# Altium schematic sheet Power.SchDoc: Power
size A3; DocumentNumber: MB1144; Revision: C-02; SheetNumber: 7; SheetTotal: 25; Project: STM32L476G-EVAL; ModifiedDate: 9/23/2015
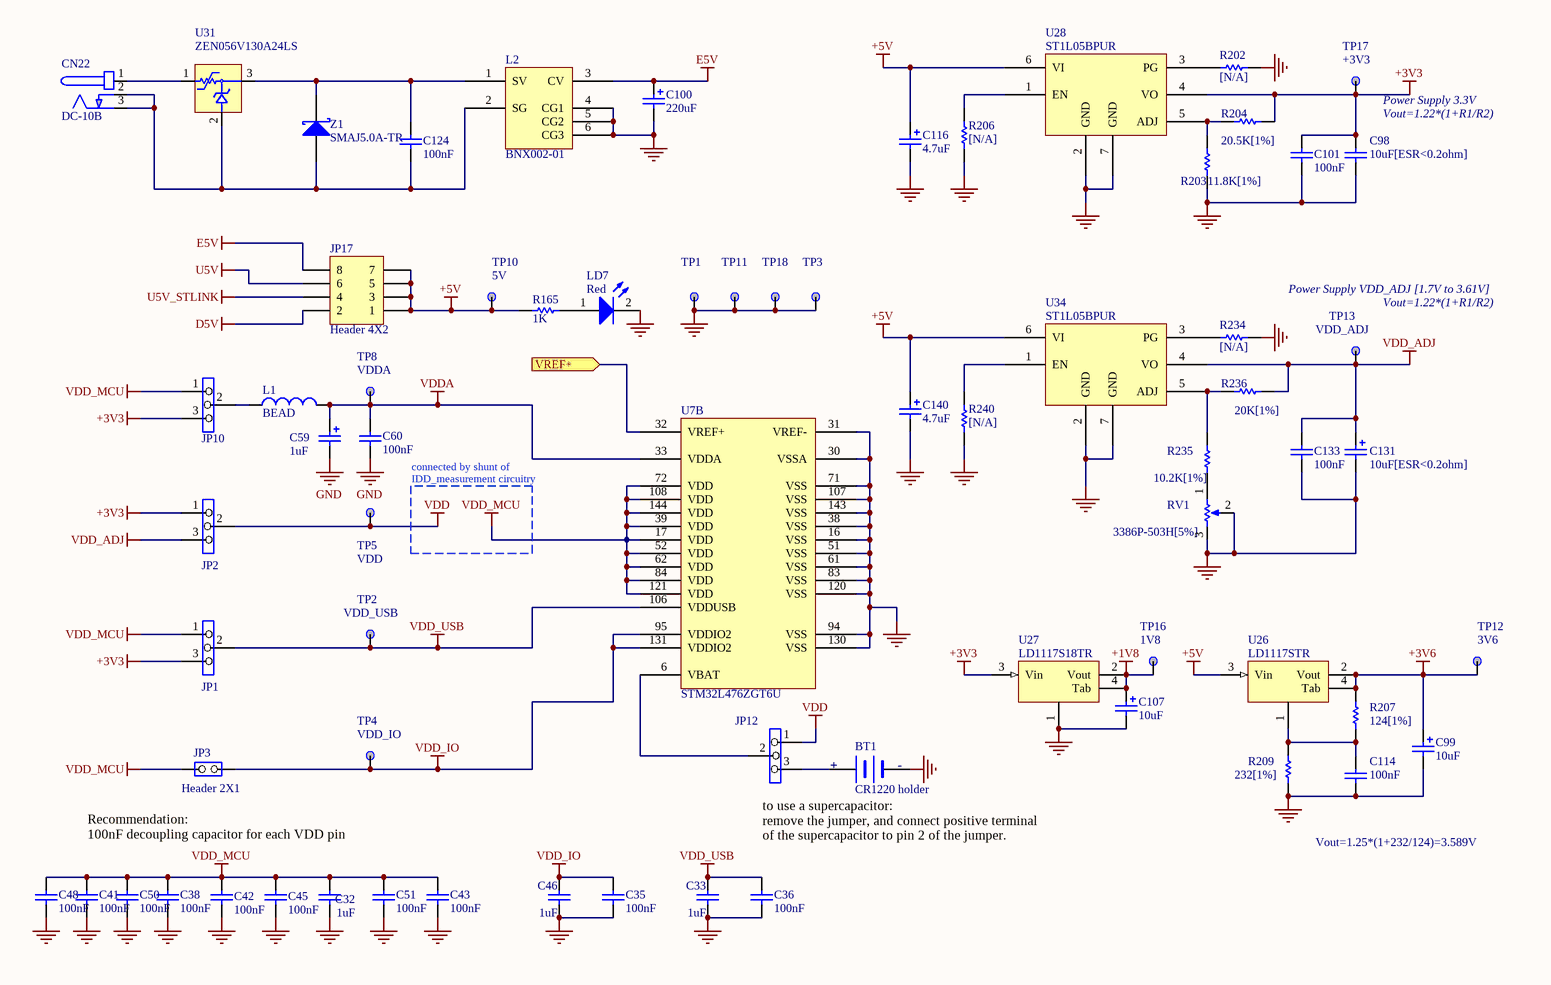
[diagram p0: Power.SchDoc]

## Parts
BT1  CR1220 holder  [BAT_2SM_CR1220]
C32  1uF  [0603C]
C33  1uF  [0603C]
C35  100nF  [0402C]
C36  100nF  [0402C]
C38  100nF  [0402C]
C41  100nF  [0402C]
C42  100nF  [0402C]
C43  100nF  [0402C]
C45  100nF  [0402C]
C46  1uF  [0603C]
C48  100nF  [0402C]
C50  100nF  [0402C]
C51  100nF  [0402C]
C59  1uF  [TAN-A]
C60  100nF  [0402C]
C98  10uF[ESR<0.2ohm]  [0805C]
C99  10uF  [TAN-A]
C100  220uF  [c310m-6]
C101  100nF  [0402C]
C107  10uF  [TAN-A]
C114  100nF  [0402C]
C116  4.7uF  [TAN-A]
C124  100nF  [0402C]
C131  10uF[ESR<0.2ohm]  [0805C]
C133  100nF  [0402C]
C140  4.7uF  [TAN-A]
CN22  DC-10B  [PWR_JACK_DC10]
JP1  Header 3X1  [SIP3]  (value not drawn)
JP2  Header 3X1  [SIP3]  (value not drawn)
JP3  Header 2X1  [SIP2]
JP10  Header 3X1  [SIP3]  (value not drawn)
JP12  Header 3X1  [SIP3]  (value not drawn)
JP17  Header 4X2  [HDR_2X4_2R54]
L1  BEAD  [0603L]
L2  BNX002-01  [BNX001]
LD7  Red  [0603D]
R165  1K  [0402R]
R202  [N/A]  [0603R]
R203  11.8K[1%]  [0603R]
R204  20.5K[1%]  [0603R]
R206  [N/A]  [0603R]
R207  124[1%]  [0603R]
R209  232[1%]  [0603R]
R234  [N/A]  [0603R]
R235  10.2K[1%]  [0603R]
R236  20K[1%]  [0603R]
R240  [N/A]  [0603R]
RV1  3386P-503H[5%]  [3386P]
TP1  [N/A]  [TP]  (value not drawn)
TP2  TP Name: VDD_USB  [TP]  (hidden comment: [N/A])
TP3  [N/A]  [TP]  (value not drawn)
TP4  TP Name: VDD_IO  [TP]  (hidden comment: [N/A])
TP5  TP Name: VDD  [TP]  (hidden comment: [N/A])
TP8  TP Name: VDDA  [TP]  (hidden comment: [N/A])
TP10  TP Name: 5V  [TP]  (hidden comment: [N/A])
TP11  [N/A]  [TP]  (value not drawn)
TP12  TP Name: 3V6  [TP]  (hidden comment: [N/A])
TP13  TP Name: VDD_ADJ  [TP]  (hidden comment: [N/A])
TP16  TP Name: 1V8  [TP]  (hidden comment: [N/A])
TP17  TP Name: +3V3  [TP]  (hidden comment: [N/A])
TP18  [N/A]  [TP]  (value not drawn)
U7  STM32L476ZGT6U  [TQFP144_0R5_22X22_SOCKET]  (part B of 3)
U26  LD1117STR  [SOT-223]
U27  LD1117S18TR  [SOT-223]
U28  ST1L05BPUR  [DFN6_0R95_3X3]
U31  ZEN056V130A24LS  [TYCO_ZEN056V130A24LS]
U34  ST1L05BPUR  [DFN6_0R95_3X3]
Z1  SMAJ5.0A-TR  [sma]

## Ports
VREF+ (in)

## Nets
+1V8: C107.1 TP16.1 U27.2(Vout) U27.4(Tab)
+3V3: C98.1 C101.1 JP1.3 JP2.1 JP10.3 R204.1 TP17.1 U27.3(Vin) U28.4(VO)
+3V6: C99.1 R207.2 TP12.1 U26.2(Vout) U26.4(Tab)
+5V: C116.1 C140.1 JP17.1 JP17.3 JP17.5 JP17.7 R165.2 TP10.1 U26.3(Vin) U28.6(VI) U34.6(VI)
D5V: JP17.2
E5V: C100.1 JP17.8 L2.3(CV)
GND: BT1.2(-) C32.2 C33.2 C35.1 C36.1 C38.1 C41.1 C42.2 C43.1 C45.2 C46.2 C48.1 C50.1 C51.1 C59.2 C60.1 C98.2 C99.2 C100.2 C101.2 C107.2 C114.2 C116.2 C131.2 C133.2 C140.2 L2.4(CG1) L2.5(CG2) L2.6(CG3) LD7.2(K) R202.1 R203.2 R206.2 R209.1 R234.1 R240.2 RV1.2(TAP) RV1.3(TOP) TP1.1 TP3.1 TP11.1 TP18.1 U7.16(VSS) U7.30(VSSA) U7.31(VREF-) U7.38(VSS) U7.51(VSS) U7.61(VSS) U7.71(VSS) U7.83(VSS) U7.94(VSS) U7.107(VSS) U7.120(VSS) U7.130(VSS) U7.143(VSS) U27.1 U28.2(GND) U28.7(GND) U34.2(GND) U34.7(GND)
U5V: JP17.6
U5V_STLINK: JP17.4
VDD: JP2.2 JP12.1 TP5.1
VDD_ADJ: C131.1 C133.1 JP2.3 R236.1 TP13.1 U34.4(VO)
VDD_IO: C35.2 C46.1 JP3.2(NO) TP4.1 U7.95(VDDIO2) U7.131(VDDIO2)
VDD_MCU: C32.1 C38.2 C41.2 C42.1 C43.2 C45.1 C48.2 C50.2 C51.2 JP1.1 JP3.1(COMMON) JP10.1 U7.17(VDD) U7.39(VDD) U7.52(VDD) U7.62(VDD) U7.72(VDD) U7.84(VDD) U7.108(VDD) U7.121(VDD) U7.144(VDD)
VDD_USB: C33.1 C36.2 JP1.2 TP2.1 U7.106(VDDUSB)
VDDA: C59.1 C60.2 L1.2 TP8.1 U7.33(VDDA)
VREF+: U7.32(VREF+) ; port VREF+
NetBT1_1: BT1.1(+) JP12.3
NetC114_1: C114.1 R207.1 R209.2 U26.1
NetC124_1: C124.1 L2.1(SV) U31.3 Z1.2(K)
NetC124_2: C124.2 CN22.2(GND) CN22.3(GND) L2.2(SG) U31.2 Z1.1(A)
NetCN22_1: CN22.1(+) U31.1
NetJP10_2: JP10.2 L1.1
NetJP12_2: JP12.2 U7.6(VBAT)
NetLD7_1: LD7.1(A) R165.1
NetR202_2: R202.2 U28.3(PG)
NetR203_1: R203.1 R204.2 U28.5(ADJ)
NetR206_1: R206.1 U28.1(EN)
NetR234_2: R234.2 U34.3(PG)
NetR235_1: R235.1 R236.2 U34.5(ADJ)
NetR235_2: R235.2 RV1.1(BOT)
NetR240_1: R240.1 U34.1(EN)

## Notes on the sheet
- Power Supply 3.3V
- Vout=1.22*(1+R1/R2)
- Power Supply VDD_ADJ [1.7V to 3.61V]
- (near TP13) Vout=1.22*(1+R1/R2)
- connected by shunt of
  IDD_measurement circuitry
- (near BT1) +
- (near BT1) -
- Recommendation:
  100nF decoupling capacitor for each VDD pin
- to use a supercapacitor:
  remove the jumper, and connect positive terminal
  of the supercapacitor to pin 2 of the jumper.
- Vout=1.25*(1+232/124)=3.589V
- Title:
- Project:
- Size:
- Date:
- A3
- Reference:
- Sheet:
- Revision:
- of

## Library data of the parts
BT1 = BATTERY: Ordered by: Subcon; Assembly: with battery; ECCN_US/EU: NA
C32 C33 C46 = CAP: Capacitor; Value: 100nF; Ordered by: Subcon; ECCN_US/EU: NA; Published: 8-Jun-2000; Revision: July-2002: Re-released for DXP Platform.; Publisher: Altium Limited
C35 C36 C60 C98 C101 C114 C133 = Cap: Capacitor; Value: 10nF; Ordered by: Subcon; ECCN_US/EU: NA; Published: 8-Jun-2000; Revision: July-2002: Re-released for DXP Platform.; Publisher: Altium Limited
C38 C41-C43 C45 C48 C50 C51 = CAP: Capacitor; Ordered by: Subcon; ECCN_US/EU: NA; Published: 8-Jun-2000; Revision: July-2002: Re-released for DXP Platform.; Publisher: Altium Limited; Value: 100nF
C59 C131 = Cap Pol1: Polarized Capacitor (Radial); Value: 10uF; Ordered by: Subcon; ECCN_US/EU: NA; Published: 8-Jun-2000; Revision: July-2002: Re-released for DXP Platform.; Publisher: Altium Limited
C99 = Cap Pol1: Polarized Capacitor (Radial); ECCN_US/EU: NA; Ordered by: Subcon; Published: 8-Jun-2000; Revision: July-2002: Re-released for DXP Platform.; Publisher: Altium Limited; Value: 10uF
C100 = Cap Pol1: Polarized Capacitor (Radial); Value: 47uF; Ordered by: Subcon; ECCN_US/EU: NA; Published: 8-Jun-2000; Revision: July-2002: Re-released for DXP Platform.; Publisher: Altium Limited
C107 = Cap Pol1: Polarized Capacitor (Radial); Ordered by: Subcon; ECCN_US/EU: NA; Published: 8-Jun-2000; Revision: July-2002: Re-released for DXP Platform.; Publisher: Altium Limited; Value: 10uF
C116 C140 = Cap Pol1: Polarized Capacitor (Radial); Value: 100pF; Ordered by: Subcon; ECCN_US/EU: NA; Published: 8-Jun-2000; Revision: July-2002: Re-released for DXP Platform.; Publisher: Altium Limited
C124 = CAP: Capacitor; Value: 100pF; Ordered by: Subcon; ECCN_US/EU: NA; Published: 8-Jun-2000; Revision: July-2002: Re-released for DXP Platform.; Publisher: Altium Limited
CN22 = PJ202A: Ordered by: Subcon; Comments: power jack; ECCN_US/EU: NA
JP1 JP2 JP10 JP12 = Jumper3: Ordered by: Subcon; ECCN_US/EU: NA
JP3 = JP2: Ordered by: Subcon; ECCN_US/EU: NA
JP17 = Header 4X2: Header, 4-Pin, Dual row; Ordered by: Subcon; ECCN_US/EU: NA; Revision: 17-Jul-2002: Re-released for DXP Platform.; Publisher: Altium Limited
L1 = Inductor: Value: 100uH; Ordered by: Subcon; ECCN_US/EU: NA; Published: 8-Jun-2000; Revision: July-2002: Re-released for DXP Platform.; Publisher: Altium Limited
L2 = BNX002: Ordered by: Subcon; ECCN_US/EU: NA
LD7 = LED2: Typical RED, GREEN, YELLOW, AMBER GaAs LED; Ordered by: Subcon; ECCN_US/EU: NA; Published: 8-Jun-2000; Revision: July-2002: Re-released for DXP Platform.; Publisher: Altium Limited
R165 = res1: Resistor; Ordered by: Subcon; ECCN_US/EU: NA; Published: 8-Jun-2000; Revision: July-2002: Re-released for DXP Platform.; Publisher: Altium Limited; Value: 1K
R202 R206 R234 R240 = res1: Resistor; Value: 1K; Ordered by: Subcon; ECCN_US/EU: NA; Fitted: NO; Published: 8-Jun-2000; Revision: July-2002: Re-released for DXP Platform.; Publisher: Altium Limited
R203 R204 R235 R236 = Res1: Resistor; Value: 1K; Ordered by: Subcon; ECCN_US/EU: NA; Published: 8-Jun-2000; Revision: July-2002: Re-released for DXP Platform.; Publisher: Altium Limited
R207 R209 = Res1: Resistor; Value: 1K; ECCN_US/EU: NA; Ordered by: Subcon; Published: 8-Jun-2000; Revision: July-2002: Re-released for DXP Platform.; Publisher: Altium Limited
RV1 = RV: Potentiometer 50K; Ordered by: Subcon; Comments: 50K potentiometer; ECCN_US/EU: NA
TP1 TP3 TP11 TP18 = TP: TP Name: GND; Ordered by: Subcon; Fitted or not fitted: NO; ECCN_US/EU: NA; Fitted: NO
TP2 TP4 TP5 TP8 TP10 TP12 TP13 TP16 TP17 = TP: Ordered by: Subcon; Fitted or not fitted: NO; ECCN_US/EU: NA; Fitted: NO
U7 = STM32L476_TQFP144: Manuf_Part_1: STM32L476ZGT6U cut1.3; Ordered by: ST; ECCN_US/EU: 3A991A2/NEC; Assembly: MCU; Ref St: 9175195; Manuf_1: ST
U26 = LD1117: Ordered by: ST; ECCN_US/EU: EAR99/NEC; Ref St: 9176138; Manuf_1: ST; Manuf_Part_1: LD1117STR
U27 = LD1117: Ordered by: ST; ECCN_US/EU: EAR99/NEC; Ref St: 9176180; Manuf_1: ST; Manuf_Part_1: LD1117S18TR
U28 U34 = ST1L05: Ordered by: ST; ECCN_US/EU: EAR99/NEC; Ref St: 9176239; Manuf_1: ST; Manuf_Part_1: ST1L05BPUR
U31 = ZEN056V130A24LS: Manuf_1: TYCO; Ordered by: Subcon; ECCN_US/EU: EAR99/NEC; Manuf_Part_1: ZEN056V130A24LS
Z1 = D Schottky: Schottky Diode; Code - JEDEC: DO-214-AA; Ordered by: ST; ECCN_US/EU: EAR99/NEC; Ref St: 9151107; Published: 8-Jun-2000; Revision: July-2002: Re-released for DXP Platform.; Publisher: Altium Limited; Manuf_1: ST; Manuf_Part_1: SMAJ5.0A-TR